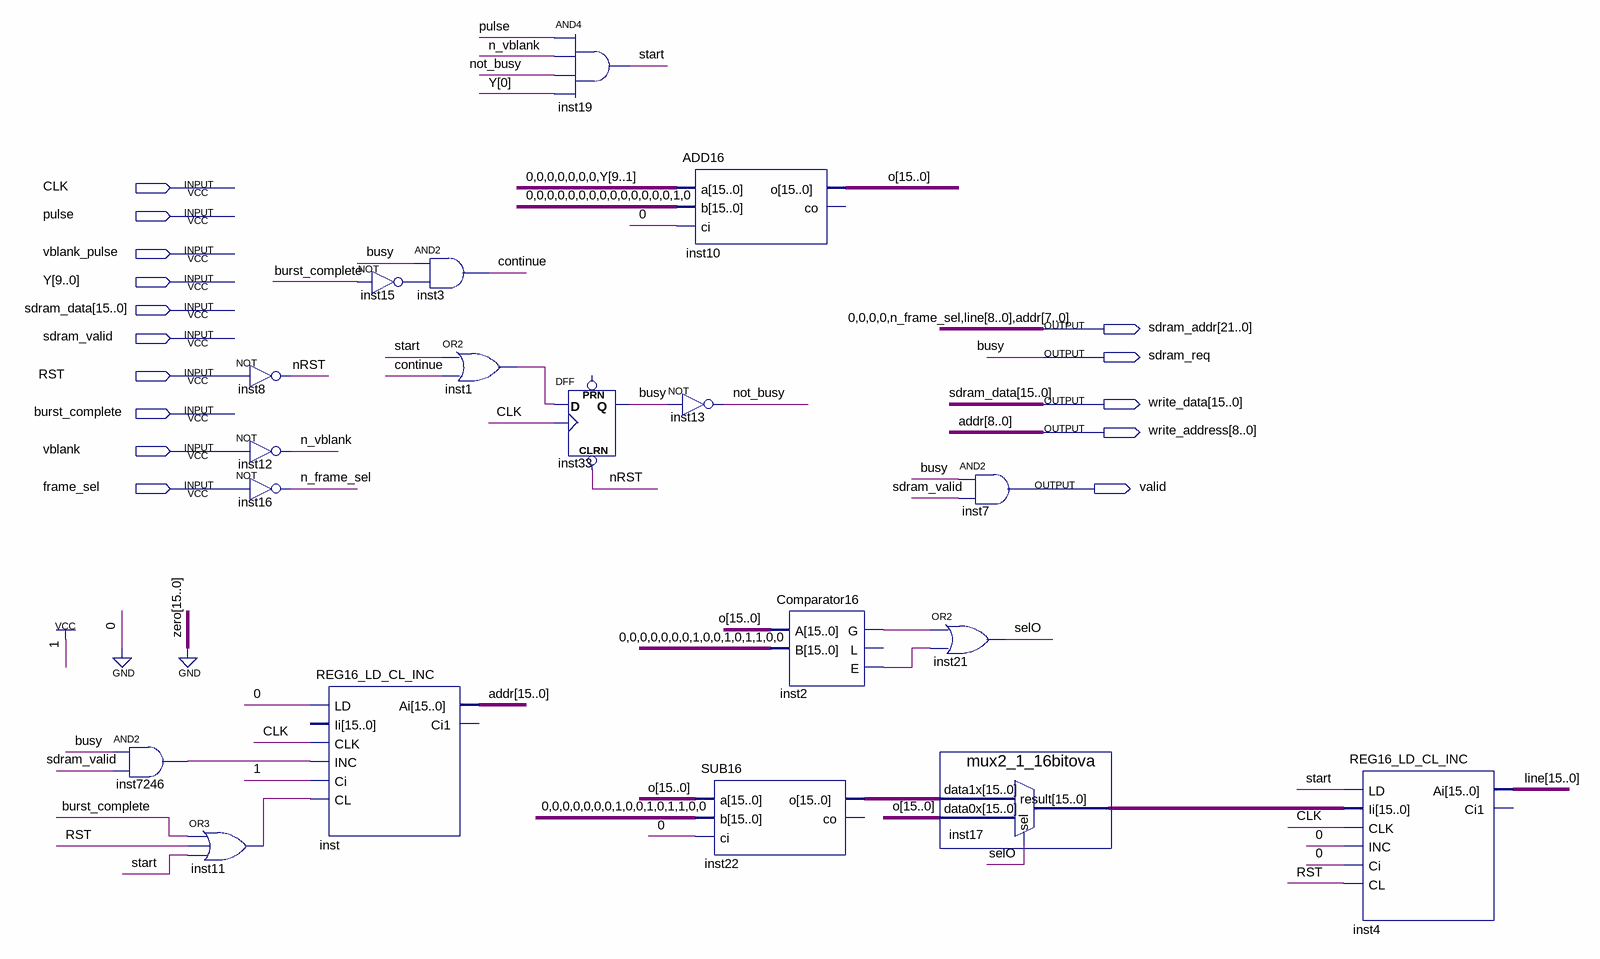
[diagram p0: schematic sheet]
// Quartus schematic Filler.bdf as structural Verilog: 19 symbols, 15 pins
module Filler (
  input  CLK,
  input  pulse,
  input  vblank_pulse,
  input  [9:0] Y,
  input  [15:0] sdram_data,
  input  sdram_valid,
  input  RST,
  input  burst_complete,
  input  vblank,
  input  frame_sel,
  output [21:0] sdram_addr,
  output sdram_req,
  output [15:0] write_data,
  output [8:0] write_address,
  output valid
);

  wire \continue , inst1_out, inst2_e, inst2_g, inst11_out, inst15_out, inst7246_out, n_vblank, not_busy,
       nRST, selO, start;
  wire [15:0] inst17_result, inst22_o, o;
  wire [15:9] addr, line;

  and inst7246 (inst7246_out, sdram_req, sdram_valid);
  or inst11 (inst11_out, burst_complete, RST, start);
  not inst8 (nRST, RST);
  not inst12 (n_vblank, vblank);
  not inst16 (sdram_addr[17], frame_sel);
  REG16_LD_CL_INC inst (
    .LD(1'b0), .CLK(CLK), .INC(inst7246_out), .Ci(1'b1), .CL(inst11_out),
    .Ai({addr, write_address[8], sdram_addr[7:0]}));  // open: Ii, Ci1
  and inst3 (\continue , sdram_req, inst15_out);
  not inst15 (inst15_out, burst_complete);
  or inst1 (inst1_out, start, \continue );
  and inst19 (start, pulse, n_vblank, not_busy, Y[0]);
  DFF inst33 (.CLRN(nRST), .CLK(CLK), .D(inst1_out), .Q(sdram_req));  // open: PRN
  ADD16 inst10 (.a({{7{1'b0}}, Y[9:1]}), .b(16'b0000000000000010), .ci(1'b0), .o(o));  // open: co
  not inst13 (not_busy, sdram_req);
  SUB16 inst22 (.a(o), .b(16'b0000000100101100), .ci(1'b0), .o(inst22_o));  // open: co
  Comparator16 inst2 (.A(o), .B(16'b0000000100101100), .G(inst2_g), .E(inst2_e));  // open: L
  or inst21 (selO, inst2_g, inst2_e);
  mux2_1_16bitova inst17 (.data1x(inst22_o), .data0x(o), .sel(selO), .result(inst17_result));
  and inst7 (valid, sdram_req, sdram_valid);
  REG16_LD_CL_INC inst4 (
    .LD(start), .Ii(inst17_result), .CLK(CLK), .INC(1'b0), .Ci(1'b0), .CL(RST), .Ai({line, sdram_addr[16:8]}));  // open: Ci1

  assign sdram_addr[21:18] = 4'b0000;
  assign write_address[7:0] = sdram_addr[7:0];
  assign write_data = sdram_data;

  // Other names for the same wires on the sheet: addr[8:0] = {write_address[8], sdram_addr[7:0]}; busy = sdram_req;
  //   line[8:0] = sdram_addr[16:8]; n_frame_sel = sdram_addr[17]
endmodule
